# Altium schematic sheet Sheet1.SchDoc
size A; SheetNumber: 1; SheetTotal: 2
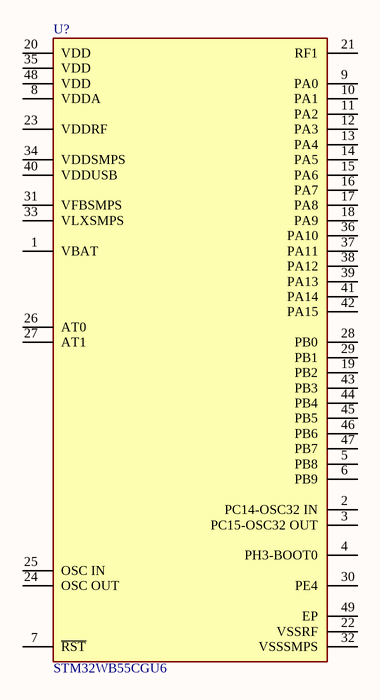
[diagram p0: Sheet1.SchDoc]

## Parts
U?  STM32WB55CGU6  [FP-STM32WB55CGU6-MFG]

## Nets

Not connected (* = marked no-connect by the designer): U? 1(VBAT) 2(PC14-OSC32_IN) 3(PC15-OSC32_OUT) 4(PH3-BOOT0) 5(PB8) 6(PB9) 7(~{RST}) 8(VDDA) 9(PA0) 10(PA1) 11(PA2) 12(PA3) 13(PA4) 14(PA5) 15(PA6) 16(PA7) 17(PA8) 18(PA9) 19(PB2) 20(VDD) 21(RF1) 22(VSSRF) 23(VDDRF) 24(OSC_OUT) 25(OSC_IN) 26(AT0) 27(AT1) 28(PB0) 29(PB1) 30(PE4) 31(VFBSMPS) 32(VSSSMPS) 33(VLXSMPS) 34(VDDSMPS) 35(VDD) 36(PA10) 37(PA11) 38(PA12) 39(PA13) 40(VDDUSB) 41(PA14) 42(PA15) 43(PB3) 44(PB4) 45(PB5) 46(PB6) 47(PB7) 48(VDD) 49(EP)

## Library data of the parts
U? = CMP-12105-000013-1: ULTRA-LOW-POWER DUAL CORE ARM CO; Manufacturer: STMicroelectronics; Number Of Cores: 1; Description: IC RF TxRx + MCU 802.15.4, Bluetooth Bluetooth v5.0 2.405GHz ~ 2.48GHz 48-UFQFN Exposed Pad; Number Of I2C Channels: 2; Interface: I2C,SPI,UART,USART,2-Wire,USB,IrDA,Other; Core Architecture: ARM Cortex-M4; Data Bus Width: 32bits; Memory Size: 1MBytes; Number Of Pwm Channels: 14; Max Supply Voltage: 3.6V; Standoff Height: 0mm; Number Of Timers/Counters: 6; Frequency: 64MHz; Max Junction Temp: +105°C; Number Of I/Os: 30; Min Supply Voltage: 1.71V; Number Of Adc Channels: 13; Ram Size: 256KBytes; Memory Type: FLASH; Octopart: https://octopart.com/stm32wb55cgu6-stmicroelectronics-98750847; Temperature Range High: +105°C; RoHS: TRUE; Number Of Spi Channels: 1; Category: IC; Device Class L1: Integrated Circuits (ICs); Lead Free: Yes; Height: 0.65mm; Number Of A/D Converters: 1; Package: UFQFPN48; Number Of Usb Channels: 1; Number Of Uart Channels: 2; Temperature Range Low: -40°C; Ambient Temperature Range Low: -40°C; Device Class L3: Microcontrollers; Manufacturer Part Number: STM32WB55CGU6; Temperature: -40°C to +105°C; ComponentLink2URL: https://www.st.com/resource/en/datasheet/stm32wb55cg.pdf; Device Class L2: Embedded Processors and Controllers; Digikey Description: ULTRA-LOW-POWER DUAL CORE ARM CO; ComponentLink2Description: Datasheet; Ambient Temperature Range High: +85°C; Automotive: No